# Altium schematic sheet 01.Main.SchDoc
size A
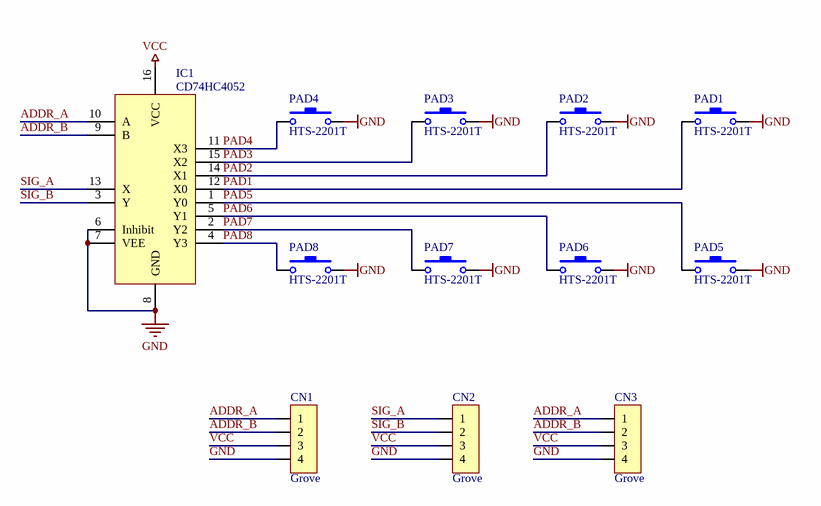
[diagram p0: 01.Main.SchDoc]

## Parts
CN1  Grove  [Grove-4P-180D]
CN2  Grove  [Grove-4P-180D]
CN3  Grove  [Grove-4P-180D]
IC1  CD74HC4052  [SOIC16]
PAD1  HTS-2201T  [ALPS-SKHC-12mm]
PAD2  HTS-2201T  [ALPS-SKHC-12mm]
PAD3  HTS-2201T  [ALPS-SKHC-12mm]
PAD4  HTS-2201T  [ALPS-SKHC-12mm]
PAD5  HTS-2201T  [ALPS-SKHC-12mm]
PAD6  HTS-2201T  [ALPS-SKHC-12mm]
PAD7  HTS-2201T  [ALPS-SKHC-12mm]
PAD8  HTS-2201T  [ALPS-SKHC-12mm]

## Nets
GND: CN1.4 CN2.4 CN3.4 IC1.6(Inhibit) IC1.7(VEE) IC1.8(GND) PAD1.1 PAD2.1 PAD3.1 PAD4.1 PAD5.1 PAD6.1 PAD7.1 PAD8.1
VCC: CN1.3 CN2.3 CN3.3 IC1.16(VCC)
ADDR_A: CN1.1 CN3.1 IC1.10(A)
ADDR_B: CN1.2 CN3.2 IC1.9(B)
PAD1: IC1.12(X0) PAD1.2
PAD2: IC1.14(X1) PAD2.2
PAD3: IC1.15(X2) PAD3.2
PAD4: IC1.11(X3) PAD4.2
PAD5: IC1.1(Y0) PAD5.2
PAD6: IC1.5(Y1) PAD6.2
PAD7: IC1.2(Y2) PAD7.2
PAD8: IC1.4(Y3) PAD8.2
SIG_A: CN2.1 IC1.13(X)
SIG_B: CN2.2 IC1.3(Y)

## Library data of the parts
CN1-CN3 = Connector 1X4
IC1 = TC74HC4052AF
PAD1-PAD8 = Tact Switch HTS-2201T